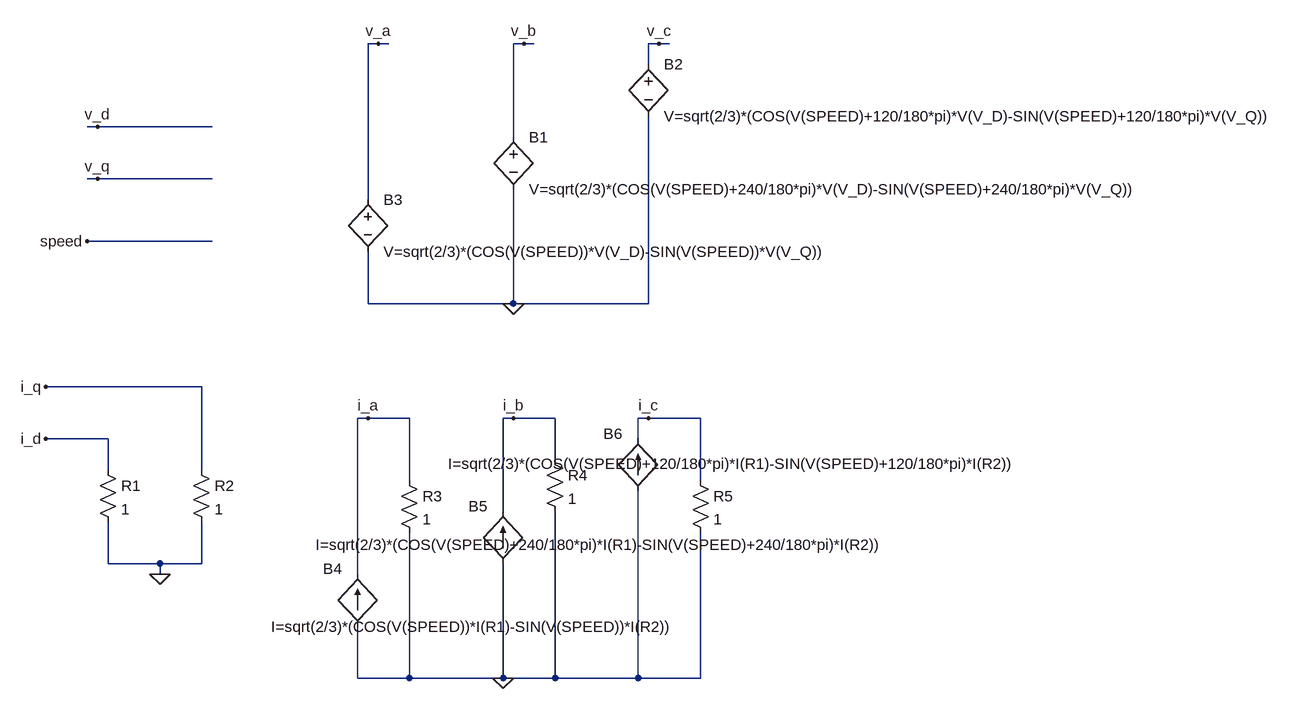
[diagram p0: schematic dq-abc.asc]
dq-abc.asc, the LTspice schematic file:
Version 4
SHEET 1 920 900
WIRE -576 -96 -592 -96
WIRE -560 -96 -576 -96
WIRE -352 -96 -368 -96
WIRE -336 -96 -352 -96
WIRE -144 -96 -160 -96
WIRE -128 -96 -144 -96
WIRE -160 -64 -160 -96
WIRE -1008 32 -1024 32
WIRE -832 32 -1008 32
WIRE -368 48 -368 -96
WIRE -1008 112 -1024 112
WIRE -832 112 -1008 112
WIRE -592 144 -592 -96
WIRE -832 208 -1024 208
WIRE -592 304 -592 224
WIRE -368 304 -368 128
WIRE -368 304 -592 304
WIRE -160 304 -160 16
WIRE -160 304 -368 304
WIRE -848 432 -1088 432
WIRE -592 480 -608 480
WIRE -528 480 -592 480
WIRE -368 480 -384 480
WIRE -304 480 -368 480
WIRE -160 480 -176 480
WIRE -80 480 -160 480
WIRE -992 512 -1088 512
WIRE -176 512 -176 480
WIRE -304 544 -304 480
WIRE -992 560 -992 512
WIRE -848 560 -848 432
WIRE -528 576 -528 480
WIRE -80 576 -80 480
WIRE -384 624 -384 480
WIRE -992 704 -992 640
WIRE -912 704 -992 704
WIRE -848 704 -848 640
WIRE -848 704 -912 704
WIRE -912 720 -912 704
WIRE -608 720 -608 480
WIRE -608 880 -608 800
WIRE -528 880 -528 656
WIRE -528 880 -608 880
WIRE -384 880 -384 704
WIRE -384 880 -528 880
WIRE -304 880 -304 624
WIRE -304 880 -384 880
WIRE -176 880 -176 592
WIRE -176 880 -304 880
WIRE -80 880 -80 656
WIRE -80 880 -176 880
FLAG -368 304 0
FLAG -576 -96 v_a
FLAG -352 -96 v_b
FLAG -144 -96 v_c
FLAG -1008 32 v_d
FLAG -1008 112 v_q
FLAG -1024 208 speed
FLAG -912 720 0
FLAG -1088 512 i_d
FLAG -1088 432 i_q
FLAG -384 880 0
FLAG -592 480 i_a
FLAG -368 480 i_b
FLAG -160 480 i_c
SYMBOL bv -368 32 R0
SYMATTR InstName B1
SYMATTR Value V=sqrt(2/3)*(COS(V(SPEED)+240/180*pi)*V(V_D)-SIN(V(SPEED)+240/180*pi)*V(V_Q))
SYMBOL bv -160 -80 R0
SYMATTR InstName B2
SYMATTR Value V=sqrt(2/3)*(COS(V(SPEED)+120/180*pi)*V(V_D)-SIN(V(SPEED)+120/180*pi)*V(V_Q))
SYMBOL bv -592 128 R0
SYMATTR InstName B3
SYMATTR Value V=sqrt(2/3)*(COS(V(SPEED))*V(V_D)-SIN(V(SPEED))*V(V_Q))
SYMBOL res -1008 544 R0
SYMATTR InstName R1
SYMATTR Value 1
SYMBOL res -864 544 R0
SYMATTR InstName R2
SYMATTR Value 1
SYMBOL bi -608 800 R180
WINDOW 0 24 88 Left 0
WINDOW 3 -488 -1 Left 0
SYMATTR InstName B4
SYMATTR Value I=sqrt(2/3)*(COS(V(SPEED))*I(R1)-SIN(V(SPEED))*I(R2))
SYMBOL bi -384 704 R180
WINDOW 0 24 88 Left 0
WINDOW 3 -592 29 Left 0
SYMATTR InstName B5
SYMATTR Value I=sqrt(2/3)*(COS(V(SPEED)+240/180*pi)*I(R1)-SIN(V(SPEED)+240/180*pi)*I(R2))
SYMBOL bi -176 592 R180
WINDOW 0 24 88 Left 0
WINDOW 3 -588 42 Left 0
SYMATTR InstName B6
SYMATTR Value I=sqrt(2/3)*(COS(V(SPEED)+120/180*pi)*I(R1)-SIN(V(SPEED)+120/180*pi)*I(R2))
SYMBOL res -544 560 R0
SYMATTR InstName R3
SYMATTR Value 1
SYMBOL res -320 528 R0
SYMATTR InstName R4
SYMATTR Value 1
SYMBOL res -96 560 R0
SYMATTR InstName R5
SYMATTR Value 1

The netlist it stands for:
* dq-abc.asc
B1 v_b 0 V=sqrt(2/3)*(COS(V(SPEED)+240/180*pi)*V(V_D)-SIN(V(SPEED)+240/180*pi)*V(V_Q))
B2 v_c 0 V=sqrt(2/3)*(COS(V(SPEED)+120/180*pi)*V(V_D)-SIN(V(SPEED)+120/180*pi)*V(V_Q))
B3 v_a 0 V=sqrt(2/3)*(COS(V(SPEED))*V(V_D)-SIN(V(SPEED))*V(V_Q))
R1 i_d 0 1
R2 i_q 0 1
B4 0 i_a I=sqrt(2/3)*(COS(V(SPEED))*I(R1)-SIN(V(SPEED))*I(R2))
B5 0 i_b I=sqrt(2/3)*(COS(V(SPEED)+240/180*pi)*I(R1)-SIN(V(SPEED)+240/180*pi)*I(R2))
B6 0 i_c I=sqrt(2/3)*(COS(V(SPEED)+120/180*pi)*I(R1)-SIN(V(SPEED)+120/180*pi)*I(R2))
R3 i_a 0 1
R4 i_b 0 1
R5 i_c 0 1
.backanno
.end